# EasyEDA schematic Prova-02-Prática.json
TITLE: Sheet_1; REV: 1.0; Date: 2020-12-02; Sheet: 1/1; Drawn By: mrrbcc; Company: Your Company
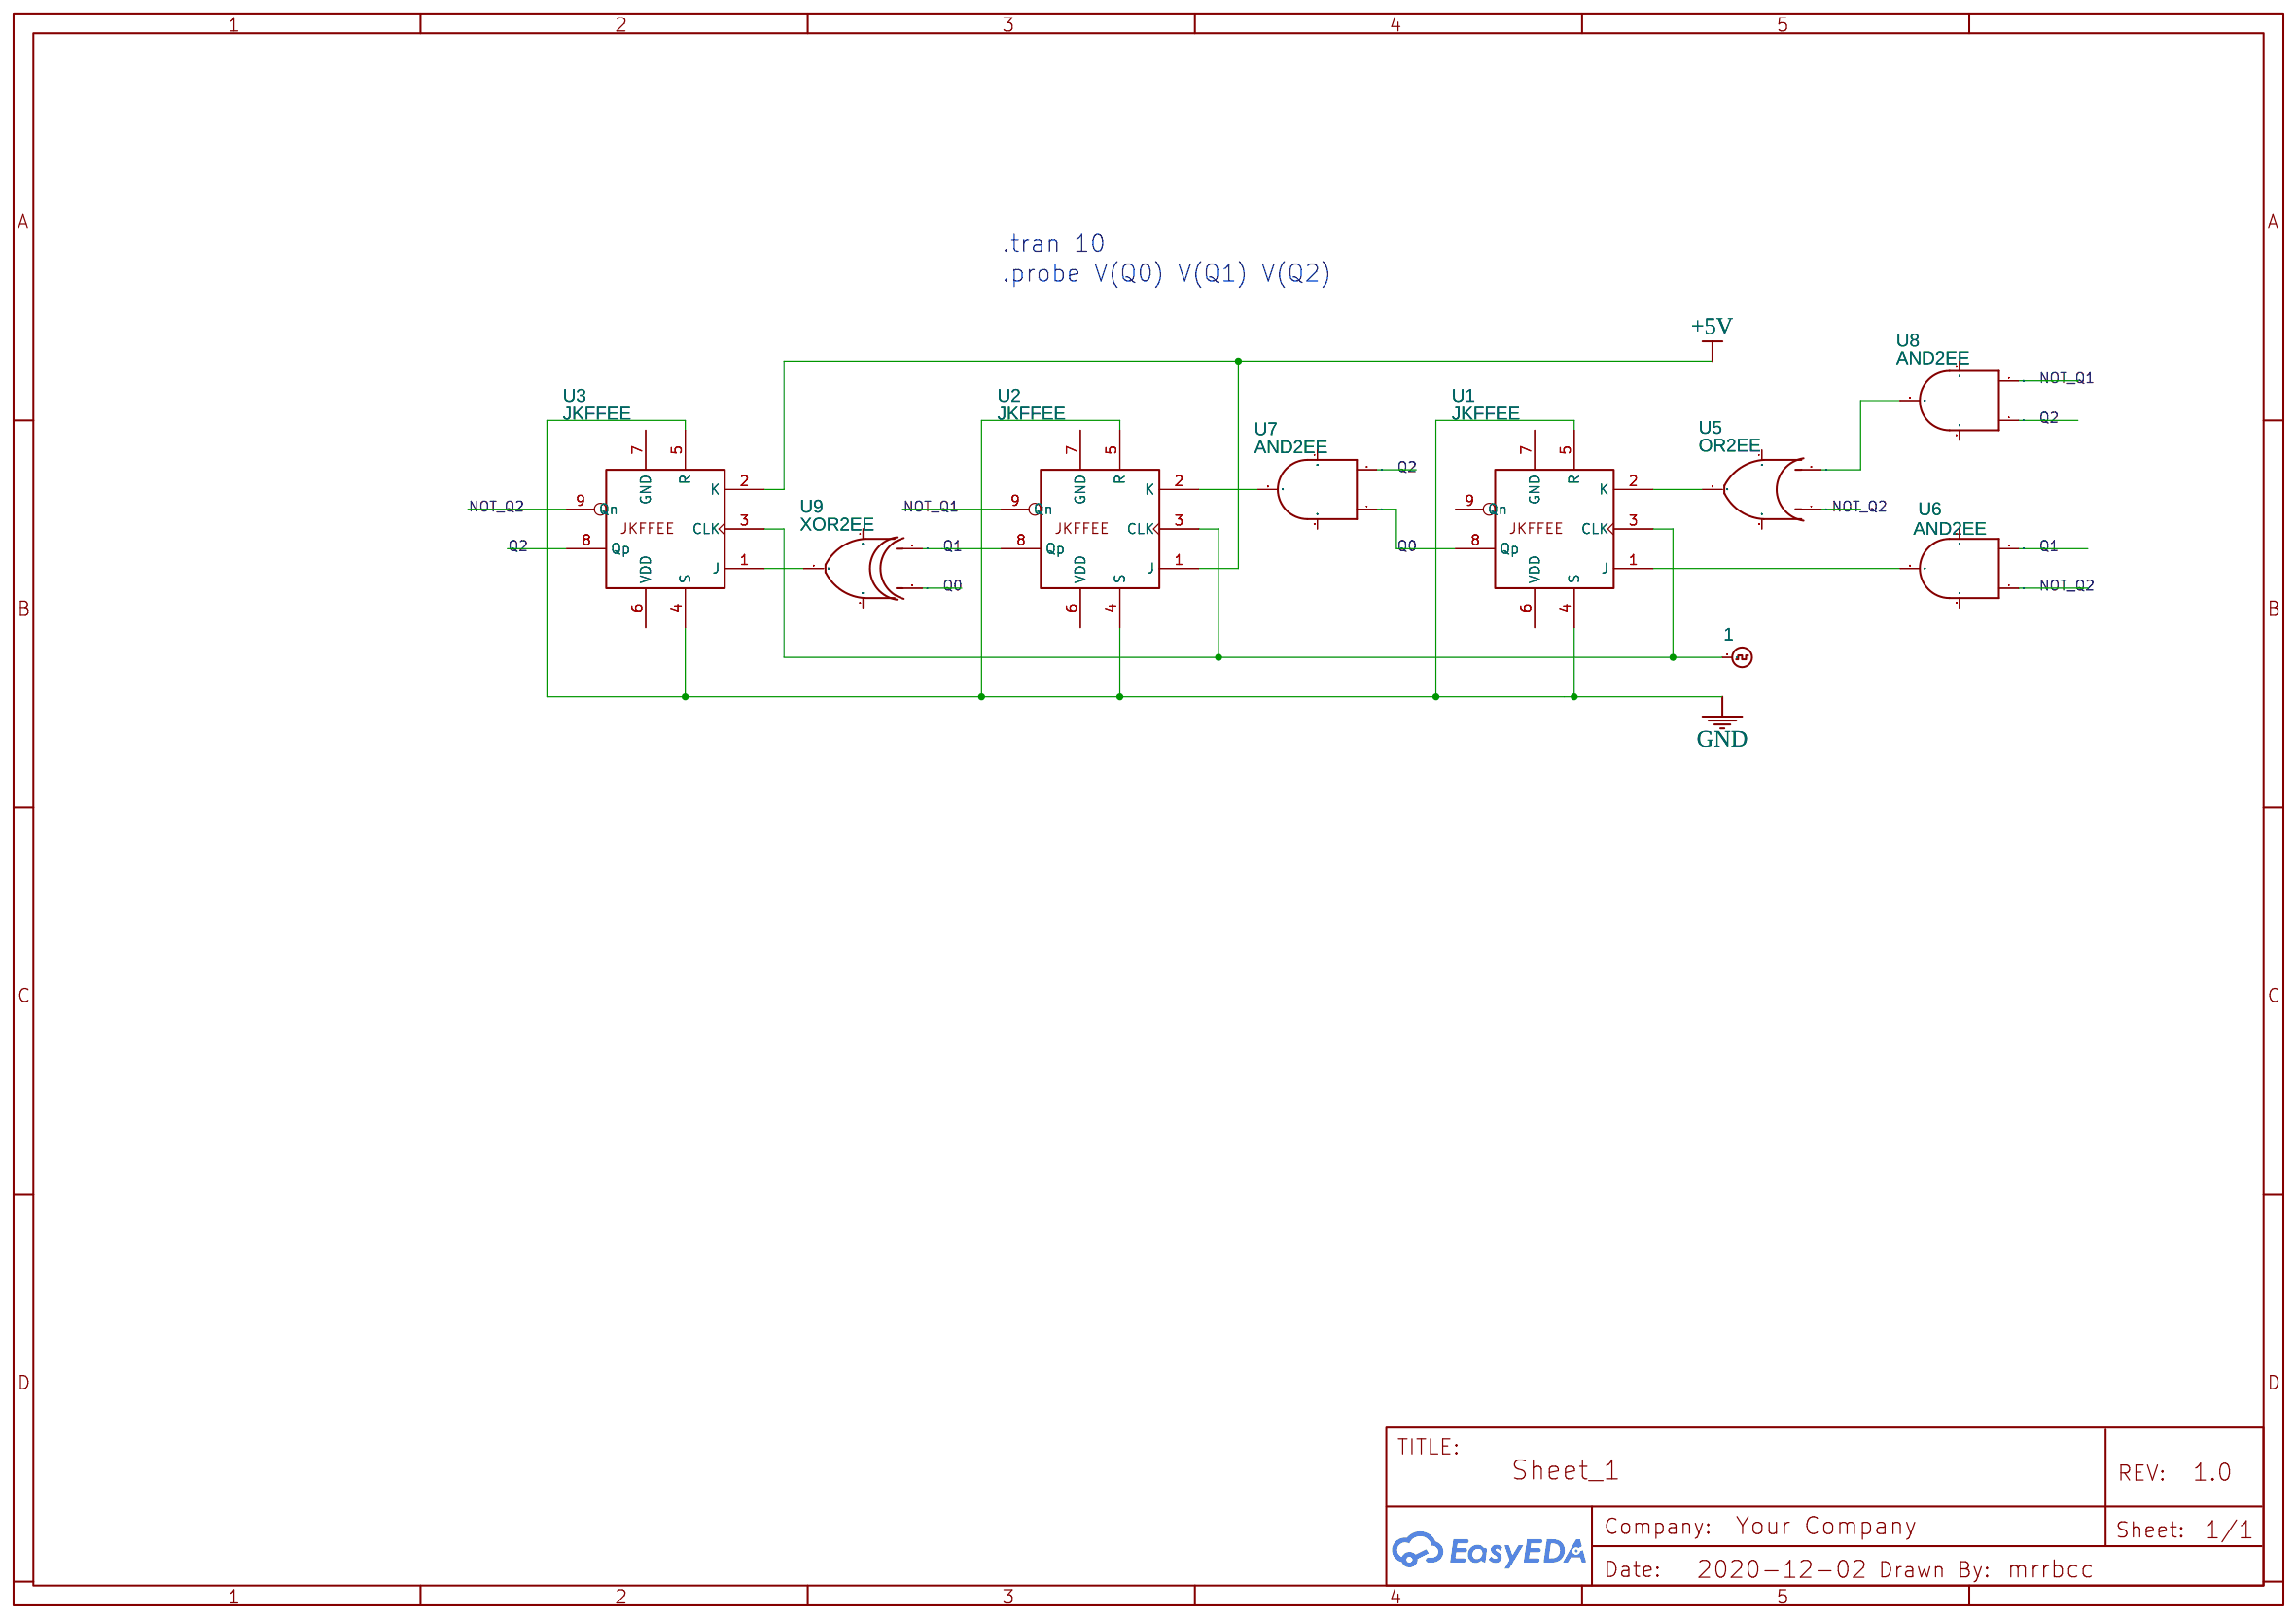
[diagram p0: schematic sheet]

## Parts
U1  JKFFEE
U2  JKFFEE
U3  JKFFEE
U4  1
U5  OR2EE
U6  AND2EE
U7  AND2EE
U8  AND2EE
U9  XOR2EE

## Library data of the parts
U1-U3 = LOGIC: Contributor: EasyEDA; sourceId: 8C82kBTN5; Supplier: YUJING
U4 = DIGITALCLOCK: Contributor: EasyEDA; PreDisplay: 0
U5-U9 = LOGIC: Contributor: EasyEDA

## Nets
+5V: U2.1(J) U3.2(K)
GND: U1.4(S) U1.5(R) U2.4(S) U2.5(R) U3.4(S) U3.5(R)
NOT_Q1: U2.9(Qn) U8.2(INB)
NOT_Q2: U3.9(Qn) U5.1(INA) U6.1(INA)
Q0: U1.8(Qp) U7.1(INA) U9.1 (INA)
Q1: U2.8(Qp) U6.2(INB) U9.2 (INB)
Q2: U3.8(Qp) U7.2(INB) U8.1(INA)
Net-(U1-1): U1.1(J) U6.5(OUT)
Net-(U1-2): U1.2(K) U5.5(OUT)
Net-(U1-3): U1.3(CLK) U2.3(CLK) U3.3(CLK) U4.1
Net-(U2-2): U2.2(K) U7.5(OUT)
Net-(U3-1): U3.1(J) U9.5(OUT)
Net-(U5-2): U5.2(INB) U8.5(OUT)

Not connected (* = marked no-connect by the designer): U1 6(VDD) 7(GND) 9(Qn); U2 6(VDD) 7(GND); U3 6(VDD) 7(GND); U5 3(VDD) 4(GND); U6 3(VDD) 4(GND); U7 3(VDD) 4(GND); U8 3(VDD) 4(GND); U9 3(VDD) 4(GND)

## Notes on the sheet
- .tran 10
- .probe V(Q0) V(Q1) V(Q2)
